# EAGLE board Lattepanda_shild_v1.4 (EAGLE 6.5.0), part 1 of 2
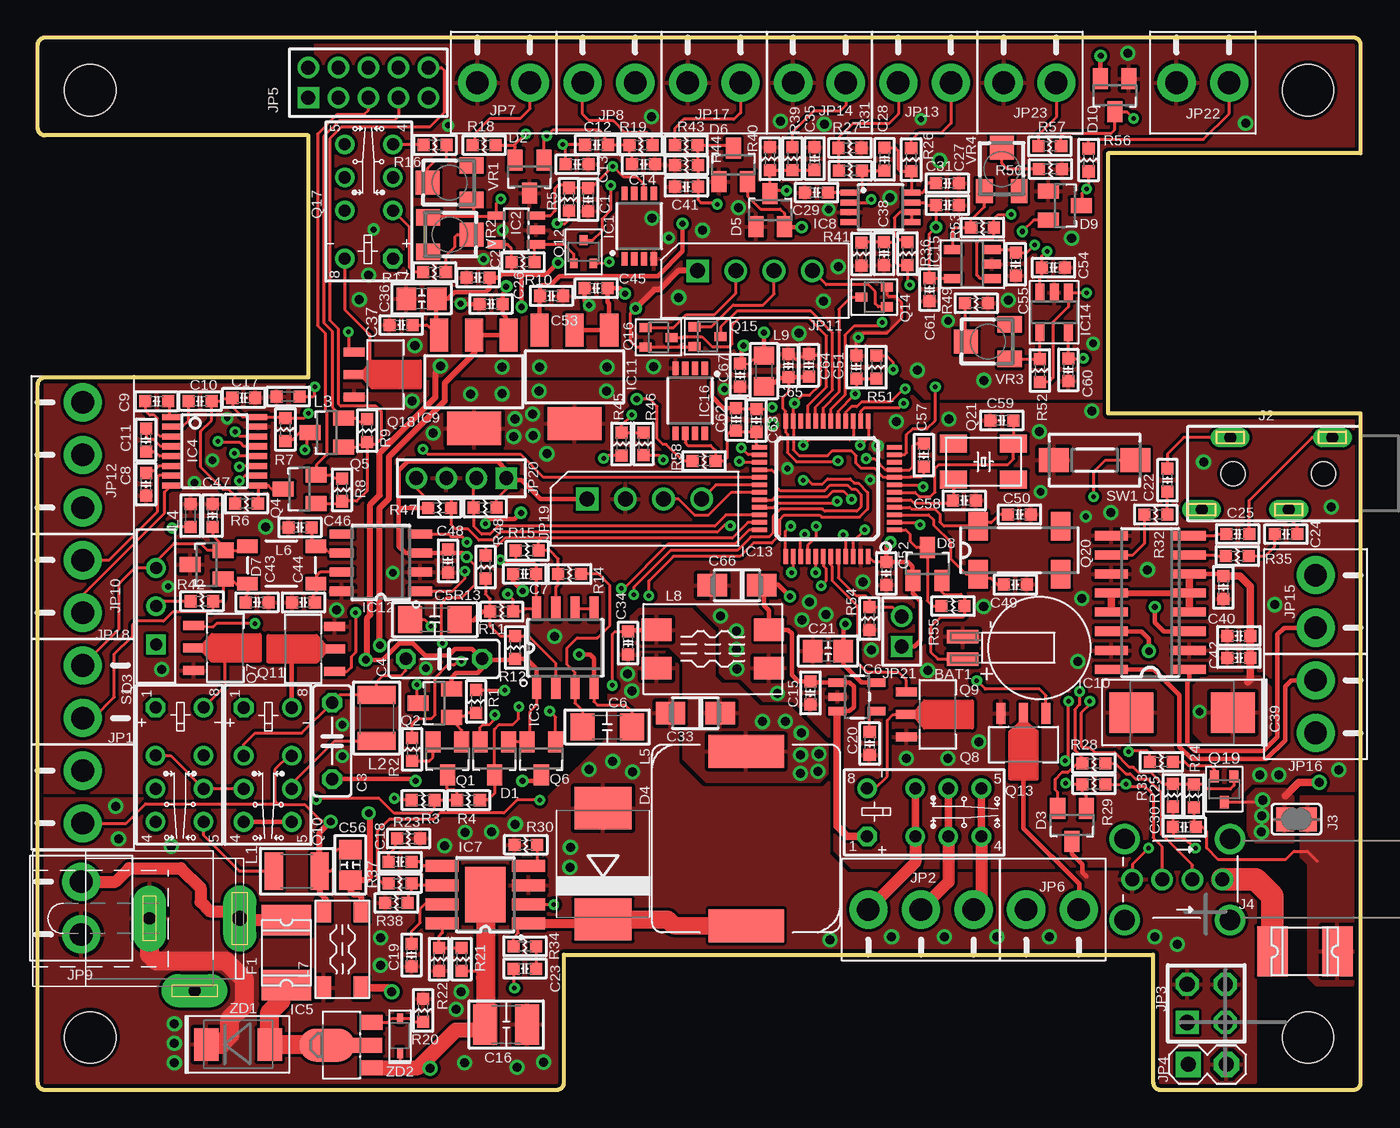
[diagram p2: board, top side]
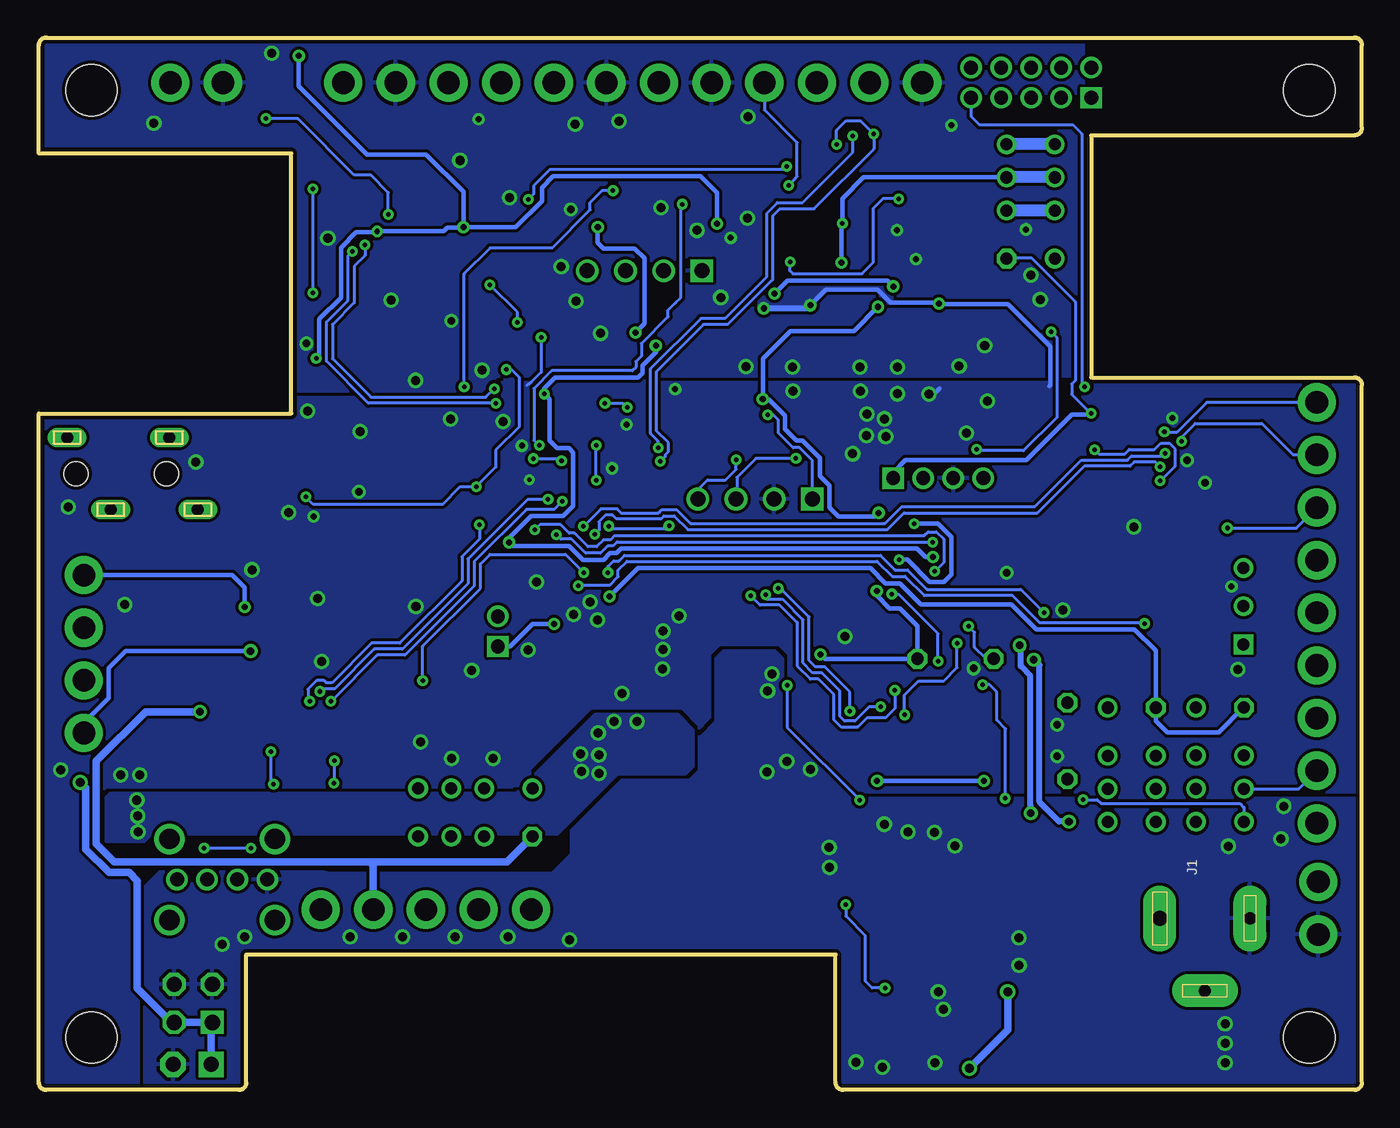
[diagram p3: board, bottom side, seen from below]

Size 88 x 70 mm. Coordinates in mm from the lower left corner, seen from the top.
Outline: 87.5,70 0.5,70 arc90 0,69.5 0,64 arc90 0.5,63.5 18,63.5 18,47.4 0.5,47.4 arc90 0,46.9 0,0.5 arc90 0.5,0 34.5,0 arc90 35,0.5 35,9 74.2,9 74.2,0.5 arc90 74.7,0 87.5,0 arc90 88,0.5 88,45 71.2,45 71.2,62.3 88,62.3 88,69.5 arc90 87.5,70
Copper layers (1*16): Top 0.035mm / dielectric 1.5mm / Bottom 0.035mm
Design rules "KHC_mm": minimum track width 0.2mm, minimum drill 0.3mm, track to track 0.2mm, track to pad 0.2mm, pad to pad 0.2mm, via to via 0.2mm, smd to smd 0.2mm, copper to edge 10mil, drill to drill 0.2mm, minimum pad ring 10mil, minimum via ring 8mil, stop-mask expansion 4mil, vias tented up to drill 0mil, thermal gap 10mil
Net classes: 0 default: clearance 0.152 mm; 1 power: width 0.152 mm; 2 GND: width 0.152 mm, clearance 0.152 mm
Holes 3.4 mm at 3.5,66.5 84.5,66.5 3.5,3.5 84.5,3.5

## Footprints (pad centres in the part's own frame; a part is rotated, then mirrored left to right if it is on the bottom)
MS621 = smd 2.1 x 0.9: + 5.1,0.75; - 5.1,-0.75
C0603 = smd 0.8 x 0.8: 1 -0.762,0; 2 0.762,0
C050-025X075 = drill 0.813 octagon: 1 -2.54,0; 2 2.54,0
C3216 = smd 1.6 x 1.8: 1 -1.651,0; 2 1.651,0
C3225 = smd 1.6 x 2.7: 1 -1.397,0; 2 1.397,0
C2012 = smd 1.3 x 1.5: 1 -1.016,0; 2 1.016,0
C1608- = smd 0.8 x 0.8: 1 -0.762,0; 2 0.762,0
C3216-18/T = smd 1.95 x 1.5: + 1.651,0; - -1.651,0
D/7343-31W = smd 2.95 x 2.7: + 3.375,0; - -3.375,0
SOT23 = smd 1 x 1.4: D 0,-1.1; G 0.95,1.1; S -0.95,1.1
SMC = smd 2.8 x 3.8: A 3.7,0; C -3.7,0
1812L = smd 2.03 x 3.3: P$1 -2.16,0; P$2 2.16,0
MS8 = smd 0.42 x 0.899: 1 -0.975,-2.166; 2 -0.325,-2.166; 3 0.325,-2.166; 4 0.975,-2.166; 5 0.975,2.166; 6 0.325,2.166; 7 -0.325,2.166; 8 -0.975,2.166
SOT23-5L = smd 0.55 x 1.2: 1 -0.95,-1.3; 2 0,-1.3; 3 0.95,-1.3; 4 0.95,1.3; 5 -0.95,1.3
SO8 = smd 0.6 x 1.6: 1 -1.905,-2.6; 2 -0.635,-2.6; 3 0.635,-2.6; 4 1.905,-2.6; 5 1.905,2.6; 6 0.635,2.6; 7 -0.635,2.6; 8 -1.905,2.6
PW_R-PDSO-G16 = smd 0.4 x 1.2: 1 -2.275,-2.9; 2 -1.625,-2.9; 3 -0.975,-2.9; 4 -0.325,-2.9; 5 0.325,-2.9; 6 0.975,-2.9; 7 1.625,-2.9; 8 2.275,-2.9; 9 2.275,2.9; 10 1.625,2.9; 11 0.975,2.9; 12 0.325,2.9; 13 -0.325,2.9; 14 -0.975,2.9; 15 -1.625,2.9; 16 -2.275,2.9
SOT89 = smd 1 x 1.5: 1 -1.499,-1.981; 3 1.499,-1.981 | smd 1 x 2: 2 0,-1.727 | smd 2.2 x 3.7: 2@1 0,0.94
SOT23-5 = smd 0.55 x 1.2: 1 -0.95,-1.3; 2 0,-1.3; 3 0.95,-1.3; 4 0.95,1.3; 5 -0.95,1.3
S08-EP1 = smd 0.8 x 2.2: 1 -1.905,-2.87; 2 -0.635,-2.87; 3 0.635,-2.87; 4 1.905,-2.87; 5 1.905,2.87; 6 0.635,2.87; 7 -0.635,2.87; 8 -1.905,2.87 | smd 3.7 x 2.71: EX_PAD 0,0
MSOP8 = smd 0.4 x 1.2: 1 -0.975,-2.05; 2 -0.325,-2.05; 3 0.325,-2.05; 4 0.975,-2.05; 5 0.975,2.05; 6 0.325,2.05; 7 -0.325,2.05; 8 -0.975,2.05
SOT223-4 = smd 1.2 x 2.2: 1 -2.311,-3.1; 2 0,-3.1; 3 2.311,-3.1 | smd 3.6 x 2.2: 4 0,3.1
SOIC16N = smd 0.6 x 2.2: 1 -4.445,-2.6; 2 -3.175,-2.6; 3 -1.905,-2.6; 4 -0.635,-2.6; 5 0.635,-2.6; 6 1.905,-2.6; 7 3.175,-2.6; 8 4.445,-2.6; 9 4.445,2.6; 10 3.175,2.6; 11 1.905,2.6; 12 0.635,2.6; 13 -0.635,2.6; 14 -1.905,2.6; 15 -3.175,2.6; 16 -4.445,2.6
TQFP48 = smd 0.3 x 1: 1 -2.75,-4.5; 2 -2.25,-4.5; 3 -1.75,-4.5; 4 -1.25,-4.5; 5 -0.75,-4.5; 6 -0.25,-4.5; 7 0.25,-4.5; 8 0.75,-4.5; 9 1.25,-4.5; 10 1.75,-4.5; 11 2.25,-4.5; 12 2.75,-4.5; 25 2.75,4.5; 26 2.25,4.5; 27 1.75,4.5; 28 1.25,4.5; 29 0.75,4.5; 30 0.25,4.5; 31 -0.25,4.5; 32 -0.75,4.5; 33 -1.25,4.5; 34 -1.75,4.5; 35 -2.25,4.5; 36 -2.75,4.5 | smd 1 x 0.3: 13 4.5,-2.75; 14 4.5,-2.25; 15 4.5,-1.75; 16 4.5,-1.25; 17 4.5,-0.75; 18 4.5,-0.25; 19 4.5,0.25; 20 4.5,0.75; 21 4.5,1.25; 22 4.5,1.75; 23 4.5,2.25; 24 4.5,2.75; 37 -4.5,2.75; 38 -4.5,2.25; 39 -4.5,1.75; 40 -4.5,1.25; 41 -4.5,0.75; 42 -4.5,0.25; 43 -4.5,-0.25; 44 -4.5,-0.75; 45 -4.5,-1.25; 46 -4.5,-1.75; 47 -4.5,-2.25; 48 -4.5,-2.75
SOT23-5' = smd 0.6 x 1.2: 1 -0.95,-1.306; 2 0,-1.306; 3 0.95,-1.306; 4 0.95,1.306; 5 -0.95,1.306
SPC4077 = drill 0.8 pad 2.184 long: 1 -3,0; 2 0,-4.8 | drill 1 pad 2.184 long: 3 3,0
PJ-327-2 = drill 0.8 long: 1 -2.4,-1.9; 2 2.4,-4.8; 3 -2.4,-8.7; 4 2.4,-10.6 | hole 1.6: 0,-2.5; 0,-8.5
SJ = smd 1.168 x 1.6: 1 -0.762,0; 2 0.762,0
USB_AF_SIDE = drill 0.92: 1 3,0; 2 1,0; 3 -1,0; 4 -3,0 | drill 1.35: SH1 -3.5,2.7; SH2 3.5,2.7; SH3 -3.5,-2.7; SH4 3.5,-2.7
ED350V-02P = drill 1.5 pad 2.54: 1 -1.75,0; 2 1.75,0
ED350V-03P = drill 1.5 pad 2.54: 1 -3.5,0; 2 0,0; 3 3.5,0
2X02 = drill 1.016 square: 1 -1.27,-1.27 | drill 1.016 octagon: 2 -1.27,1.27; 3 1.27,-1.27; 4 1.27,1.27
MA02-1-MOL = drill 1 pad 1.676 square: 1 -1.27,0 | drill 1 pad 1.676 octagon: 2 1.27,0
2X05M = drill 0.914 square: 1 -4,-1 | drill 0.914: 2 -4,1; 3 -2,-1; 4 -2,1; 5 0,-1; 6 0,1; 7 2,-1; 8 2,1; 9 4,-1; 10 4,1
MOLEX5267-04 = drill 1 square: 1 -3.81,0 | drill 1: 2 -1.27,0; 3 1.27,0; 4 3.81,0
1X04M = drill 0.914 square: 1 -3,0 | drill 0.914: 2 -1,0; 3 1,0; 4 3,0
1X02M = drill 0.914 square: 1 -1,0 | drill 0.914: 2 1,0
L1210 = smd 1.2 x 2.5: 1 -1.524,0; 2 1.524,0
L0603 = smd 0.8 x 0.8: 1 -0.762,0; 2 0.762,0
SHP1260P-F = smd 2.2 x 5: 1 -5.8,0; 2 5.8,0
ACT45B = smd 1.35 x 0.9: 1 -2.275,1.25; 2 -2.275,-1.25; 3 2.275,-1.25; 4 2.275,1.25
SRF0602 = smd 1.5 x 1: 1 -2.55,1.25; 2 2.55,1.25; 3 2.55,-1.25; 4 -2.55,-1.25
SRF0905 = smd 2 x 1.5: 1 -3.75,1.27; 2 3.75,1.27; 3 3.75,-1.27; 4 -3.75,-1.27
L0805 = smd 1.2 x 1.3: 1 -1.016,0; 2 1.016,0
ANG200X = drill 0.8 octagon: 1 -4.3,-1.6 | drill 0.8: 2 -1.1,-1.6; 3 1.1,-1.6; 4 3.3,-1.6; 5 3.3,1.6; 6 1.1,1.6; 7 -1.1,1.6; 8 -4.3,1.6
MPT3 = smd 0.6 x 1.4: BASE -1.5,-2; EMITTER 1.5,-2 | smd 0.6 x 1.3: COLLECTOR 0,-2.05
SOT323 = smd 0.5 x 0.65: 1 0.65,-0.775; 2 -0.65,-0.775; 3 0,0.775
SC59-BEC = smd 0.6 x 0.8: 1 0.65,-0.863; 2 -0.65,-0.863; 3 0,0.863
MC-306 = smd 1.3 x 1.9: 1 -2.75,-1.6; 2 2.75,-1.6; 3 2.75,1.6; 4 -2.75,1.6
SMD5032 = smd 1.8 x 1.2: 1 -2,-1.2; 2 2,-1.2; 3 2,1.2; 4 -2,1.2
R0603 = smd 0.8 x 0.8: 1 -0.762,0; 2 0.762,0
R0603@1 = smd 0.8 x 0.8: 1 -0.762,0; 2 0.762,0
255SB = drill 0.8 square: 1 -2.54,0 | drill 0.8: 2 0,0; 3 2.54,0
DTSM-3 = smd 2 x 1.6: 1 -2.7,0; 2 2.7,0
R-TRIMMER-3313J = smd 1.1 x 1.6: 1 -1.15,-1.45; 3 1.15,-1.45 | smd 1.6 x 1.6: 2 0,1.45
SMB = smd 1.62 x 2.18: A 2.11,0; C -2.11,0
DSMM = smd 0.7 x 0.4: A 1.15,0; C -1.15,0

## Placement (x,y rotation side)
BAT1  MS621  [MS621]  66.63,29.41 180 top
C1  0.1uF  [C0603]  36.62,59.23 90 top
C2  0.1uF  [C0603]  29.29,54.04 180 top
C3  1000pF/1%  [C050-025X075]  19.59,23.22 270 top
C4  1000pF  [C050-025X075]  27.03,28.68 0 top
C5  10uF/16V  [C3216]  26.42,31.29 180 top
C6  10uF/16V  [C3216]  37.88,24.14 0 top
C7  0.1uF  [C0603]  32.39,34.33 180 top
C8  0.1uF  [C0603]  7.21,40.29 90 top
C9  0.1uF  [C0603]  7.92,45.81 0 top
C10  0.1uF  [C0603]  10.81,45.82 180 top
C11  0.1uF  [C0603]  7.21,43.23 90 top
C12  1uF  [C0603]  37.18,62.86 0 top
C13  0.1uF  [C0603]  35.88,61.57 180 top
C14  0.1uF  [C0603]  40.3,61.57 0 top
C15  1uF/10V  [C0603]  51.4,26.41 90 top
C16  10uF/35V  [C3225]  31.16,4.36 0 top
C17  0.1uF  [C0603]  13.72,46.04 180 top
C18  2.2nF/50V  [C0603]  24.11,15.18 180 top
C19  0.1uF/50V  [C0603]  24.87,8.98 270 top
C20  470pF  [C0603]  55.34,23.05 90 top
C21  4.7uF  [C2012]  52.57,29.2 180 top
C22  0.22uF  [C0603]  75.14,40.57 90 top
C23  10nF/50V  [C0603]  32.41,8.07 180 top
C24  0.22uF  [C0603]  83.03,36.97 0 top
C25  1uF  [C0603]  79.82,36.98 0 top
C26  0.1uF/50V  [C1608-]  30.15,52.28 0 top
C27  1nF  [C0603]  60.5,60.31 0 top
C28  10nF  [C0603]  56.33,61.9 270 top
C29  1nF  [C0603]  51.81,59.69 180 top
C30  0.1uF  [C0603]  76.26,17.49 180 top
C31  0.1uF  [C0603]  60.51,58.86 0 top
C32  1uF  [C0603]  78.86,33.43 270 top
C33  22uF/10V  [C3216-18/T]  43.74,25.07 0 top
C34  0.1uF  [C0603]  39.27,29.73 270 top
C35  10nF  [C0603]  51.68,61.96 90 top
C36  4.7uF  [C2012]  25.54,52.63 180 top
C37  10nF  [C1608-]  24.18,50.88 0 top
C38  1uF  [C0603]  56.29,55.62 270 top
C39  470uF  [D/7343-31W]  76.12,25.11 0 top
C40  1uF  [C0603]  79.89,30.2 0 top
C41  10nF  [C0603]  43.15,60.08 180 top
C42  0.1uF  [C0603]  79.89,28.74 0 top
C43  47pF  [C0603]  14.59,32.44 0 top
C44  47pF  [C0603]  17.68,32.43 180 top
C45  0.1uF/50V  [C0603]  37.15,53.33 180 top
C46  47pF  [C0603]  17.45,37.42 180 top
C47  47pF  [C0603]  11.64,38.21 270 top
C48  0.1uF  [C0603]  27.29,35.19 90 top
C49  12.5pF  [C0603]  65.03,33.61 180 top
C50  12.5pF  [C0603]  65.3,38.28 180 top
C51  0.1uF  [C0603]  54.45,48.09 90 top
C52  1uF  [C0603]  56.45,34.36 270 top
C53  1uF/16V  [C0603]  34.18,52.82 180 top
C54  10nF  [C0603]  67.56,54.7 180 top
C55  10nF  [C0603]  65.06,54.93 90 top
C56  2.2uF/35V  [C2012]  20.79,14.97 90 top
C57  1uF  [C0603]  58.94,42.23 90 top
C58  18pF  [C0603]  61.63,39.21 180 top
C59  18pF  [C0603]  64.13,44.54 0 top
C60  100nF  [C0603]  68.55,47.9 90 top
C61  100nF  [C0603]  59.32,53.24 90 top
C62  1uF  [C0603]  46.46,44.61 90 top
C63  10nF  [C0603]  47.8,44.54 270 top
C64  1uF  [C0603]  51.29,48.2 270 top
C65  10nF  [C0603]  49.93,48.18 270 top
C66  22uF/10V  [C3216-18/T]  46.52,33.56 0 top
C67  1uF  [C0603]  46.72,47.54 90 top
D1  BAV99  [SOT23]  30.38,22.05 0 top
D2  NUP2105  [SOT23]  32.72,60.75 0 top
D3  NUP2105  [SOT23]  68.79,17.63 0 top
D4  MBRS540T3  [SMC]  37.61,15.05 90 top
D5  BAV99  [SOT23]  48.72,58.53 180 top
D6  BAV99  [SOT23]  46.27,61.53 180 top
D7  NUP2105  [SOT23]  11.24,34.95 270 top
D8  BAT54C  [SOT23]  59.18,34.98 180 top
D9  BAV99  [SOT23]  68.31,58.82 90 top
D10  BAV99  [SOT23]  71.64,66.16 0 top
F1  1812L110/33  [1812L]  16.55,9.13 90 top
F2  FSMD300R  [1812L]  84.28,9.22 0 top
IC1  LT1634ACS-1.25  [MS8]  40.01,57.46 0 top
IC2  LT6202  [SOT23-5L]  31.84,57.2 90 top
IC3  LM311  [SO8]  35.1,29.41 0 top
IC4  MAX3232CPW  [PW_R-PDSO-G16]  11.78,42.49 270 top
IC5  CXDM4060P  [SOT89]  20.2,2.99 90 top
IC6  MIC5219-3.3V  [SOT23-5]  54.5,26.15 270 top
IC7  AOZ1284PI  [S08-EP1]  29.78,12.99 90 top
IC8  AD8495  [MSOP8]  56.06,58.71 270 top
IC9  TLE4266  [SOT223-4]  29.02,47.11 180 top
IC10  PAM8403  [SOIC16N]  74,32.42 90 top
IC11  TLE4266GSV10  [SOT223-4]  35.71,47.44 180 top
IC12  SN65HVD230  [SO8]  22.83,35.08 90 top
IC13  STM32F373X  [TQFP48]  52.5,40 90 top
IC14  LT1783  [SOT23-5']  67.61,51.73 180 top
IC15  LT1783  [SOT23-5']  62.17,54.93 90 top
IC16  LT1634ACS-2.5  [MS8]  43.4,45.85 180 top
J1  DC_POWER  [SPC4077]  10.44,11.41 0 top
J2  PJ-327  [PJ-327-2]  88.02,41 270 top
J3  B0  [SJ]  83.72,18.01 180 top
J4  USB A/F  [USB_AF_SIDE]  75.8,14 0 top
JP1  LC  [ED350V-02P]  3,19.49 270 top
JP2  RELAY1  [ED350V-03P]  58.75,12 0 top
JP3  Latte_5V  [2X02]  77.72,5.77 0 top
JP4  FAN  [MA02-1-MOL]  77.8,1.7 0 top
JP5  Latte_Intel  [2X05M]  22,67 0 top
JP6  LOW_SIDE_OUT  [ED350V-02P]  67.5,12 0 top
JP7  4WIR1  [ED350V-02P]  31,67 180 top
JP8  4WIR1  [ED350V-02P]  38,67 180 top
JP9  DC-IN  [ED350V-02P]  2.9,12.1 270 top
JP10  RS232C_LA  [ED350V-02P]  3,33.49 270 top
JP11  DI  [MOLEX5267-04]  47.71,54.49 0 top
JP12  RS232C_MCU  [ED350V-03P]  3,42.24 270 top
JP13  TC1  [ED350V-02P]  59,67 180 top
JP14  ADC1/COP1  [ED350V-02P]  52,67 180 top
JP15  L-SPEAKER  [ED350V-02P]  85,32.5 90 top
JP16  R-SPEAKER  [ED350V-02P]  85,25.5 90 top
JP17  ADC2/COP2  [ED350V-02P]  45,67 180 top
JP18  CAN-BUS  [ED350V-02P]  3,26.49 90 top
JP19  i2C  [MOLEX5267-04]  40.36,39.31 0 top
JP20  SWD  [1X04M]  28.18,40.7 180 top
JP21  BOOT  [1X02M]  57.46,30.5 90 top
JP22  DAC1  [ED350V-02P]  77.5,67 180 top
JP23  DAC1  [ED350V-02P]  66,67 180 top
L1  100uH/1812R-104F  [L1210]  17.24,14.55 0 top
L2  100uH/1812R-104F  [L1210]  22.55,24.74 90 top
L3  BEAD  [L0603]  16.67,46.13 180 top
L4  BEAD  [L0603]  10.17,38.21 90 top
L5  22uH  [SHP1260P-F]  47.12,16.73 270 top
L6  ACT45B-510-2P-TL003  [ACT45B]  16.23,34.92 180 top
L7  SRF0602-100Y  [SRF0602]  20.28,9.36 90 top
L8  SRF0905-100Y  [SRF0905]  44.9,29.34 0 top
L9  10uH  [L0805]  48.31,47.82 270 top
Q1  Si2333DS  [SOT23]  27.26,22.05 0 top
Q2  BSS138SOT23  [SOT23]  26.42,25.73 270 top
Q3  AGN2004  [ANG200X]  9.44,21.14 270 top
Q4  BSS138SOT23  [SOT23]  17.44,39.97 270 top
Q5  BSS138SOT23  [SOT23]  19.24,43.73 270 top
Q6  2N7002  [SOT23]  33.5,22.05 0 top
Q7  DTDG23YP  [MPT3]  12.39,29.41 270 top
Q8  AGN2004  [ANG200X]  59.47,18.46 0 top
Q9  DTDG23YP  [MPT3]  59.77,24.98 270 top
Q10  AGN2004  [ANG200X]  15.31,21.13 270 top
Q11  DTDG23YP  [MPT3]  17.75,29.34 90 top
Q12  2SB1694  [SOT323]  36.31,55.75 0 top
Q13  DTDG23YP  [MPT3]  65.57,23.06 180 top
Q14  DTC114EUA  [SC59-BEC]  55.64,52.74 90 top
Q15  DTC114EUA  [SC59-BEC]  44.55,50.11 270 top
Q16  DTC114EUA  [SC59-BEC]  41.3,50.06 270 top
Q17  AGN2003  [ANG200X]  22.03,59.6 90 top
Q18  DTDG23YP  [MPT3]  23.04,47.59 270 top
Q19  DTC114EUA  [SC59-BEC]  78.92,20.01 180 top
Q20  32.768k  [MC-306]  65.3,35.9 0 top
Q21  8MHz  [SMD5032]  62.91,41.79 0 top
R1  1k  [R0603]  29.17,25.84 270 top
R2  1k  [R0603]  24.9,22.66 90 top
R3  1kF  [R0603]  25.65,19.28 0 top
R4  10k  [R0603]  28.65,19.28 0 top
R5  18k  [R0603]  35.34,59.24 90 top
R6  10kF  [R0603]  13.89,39.01 180 top
R7  10kF  [R0603]  16.48,43.93 90 top
R8  10kF  [R0603]  20.25,39.92 270 top
R9  10kF  [R0603]  21.91,43.86 270 top
R10  100kF  [R0603]  32.28,55.07 180 top
R11  100k  [R0603]  30.87,31.82 0 top
R12  100k  [R0603]  31.77,29.43 90 top
R13  100k  [R0603]  29.79,34.78 90 top
R14  47k  [R0603]  35.38,34.32 180 top
R15  1k  [R0603]  32.56,35.87 180 top
R16  360  [R0603]  26.43,62.86 180 top
R17  3.6k  [R0603]  26.39,54.4 180 top
R18  499  [R0603]  29.7,62.85 0 top
R19  499  [R0603]  40.12,62.84 180 top
R20  100kF  [R0603]  25.63,5.3 90 top
R21  47k  [R0603]  28.19,8.7 270 top
R22  11k  [R0603]  26.69,8.7 90 top
R23  10kF  [R0603]  24.66,16.73 180 top
R24  10k  [R0603]  76.9,19.57 270 top
R25  10k  [R0603]  75.49,19.61 90 top
R26  10kF  [R0603]  58.1,61.88 270 top
R27  1M  [R0603]  54.03,62.66 180 top
R28  27  [R0603]  70.26,21.73 0 top
R29  27  [R0603]  70.26,20.34 0 top
R30  46.6k  [R0603]  32.47,16.31 180 top
R31  10kF  [R0603]  54.05,61.14 0 top
R32  1k  [R0603]  74.36,38.28 180 top
R33  1.5k  [R0603]  74.75,21.83 0 top
R34  0  [R0603]  32.41,9.56 180 top
R35  1k  [R0603]  79.79,35.52 180 top
R36  30kF  [R0603]  57.86,55.63 270 top
R37  52.3kF  [R0603]  24.11,13.75 180 top
R38  10kF  [R0603]  23.86,12.45 0 top
R39  115kF  [R0603]  50.2,61.95 270 top
R40  10kF  [R0603]  48.71,61.94 270 top
R41  10kF  [R0603]  54.8,55.6 90 top
R42  120  [R0603@1]  10.93,32.51 180 top
R43  115kF  [R0603]  43.14,62.85 0 top
R44  10kF  [R0603]  43.15,61.51 0 top
R45  2.2k  [R0603]  38.83,42.97 270 top
R46  2.2k  [R0603]  40.29,42.98 270 top
R47  10k  [R0603]  26.73,38.72 180 top
R48  10k  [R0603]  29.77,38.74 0 top
R49  53kF  [R0603]  62.43,52.33 180 top
R50  53kF  [R0603]  67.37,61.26 180 top
R51  10k  [R0603]  55.79,48.08 270 top
R52  30kF  [R0603]  66.66,47.86 270 top
R53  30kF  [R0603]  62.85,57.36 0 top
R54  10k  [R0603]  55.33,31.36 90 top
R55  11k  [R0603]  60.88,32.19 0 top
R56  100  [R0603]  69.9,61.86 90 top
R57  100  [R0603]  67.31,62.77 180 top
R58  18k  [R0603]  44.33,41.84 0 top
S1  CAN_TERMI  [255SB]  7.88,32.18 90 top
SW1  RESET\  [DTSM-3]  70.3,41.89 180 top
VR1  50  [R-TRIMMER-3313J]  27.4,60.35 90 top
VR2  500  [R-TRIMMER-3313J]  27.42,56.9 270 top
VR3  10k  [R-TRIMMER-3313J]  63.2,49.78 90 top
VR4  10k  [R-TRIMMER-3313J]  64.12,61.24 0 top
ZD1  SM6T39CAY  [SMB]  13.33,3.03 0 top
ZD2  RD10S  [DSMM]  24.1,3.61 90 top